# Altium schematic sheet mcu_core.SchDoc
size A4; SheetNumber: 2; SheetTotal: 6
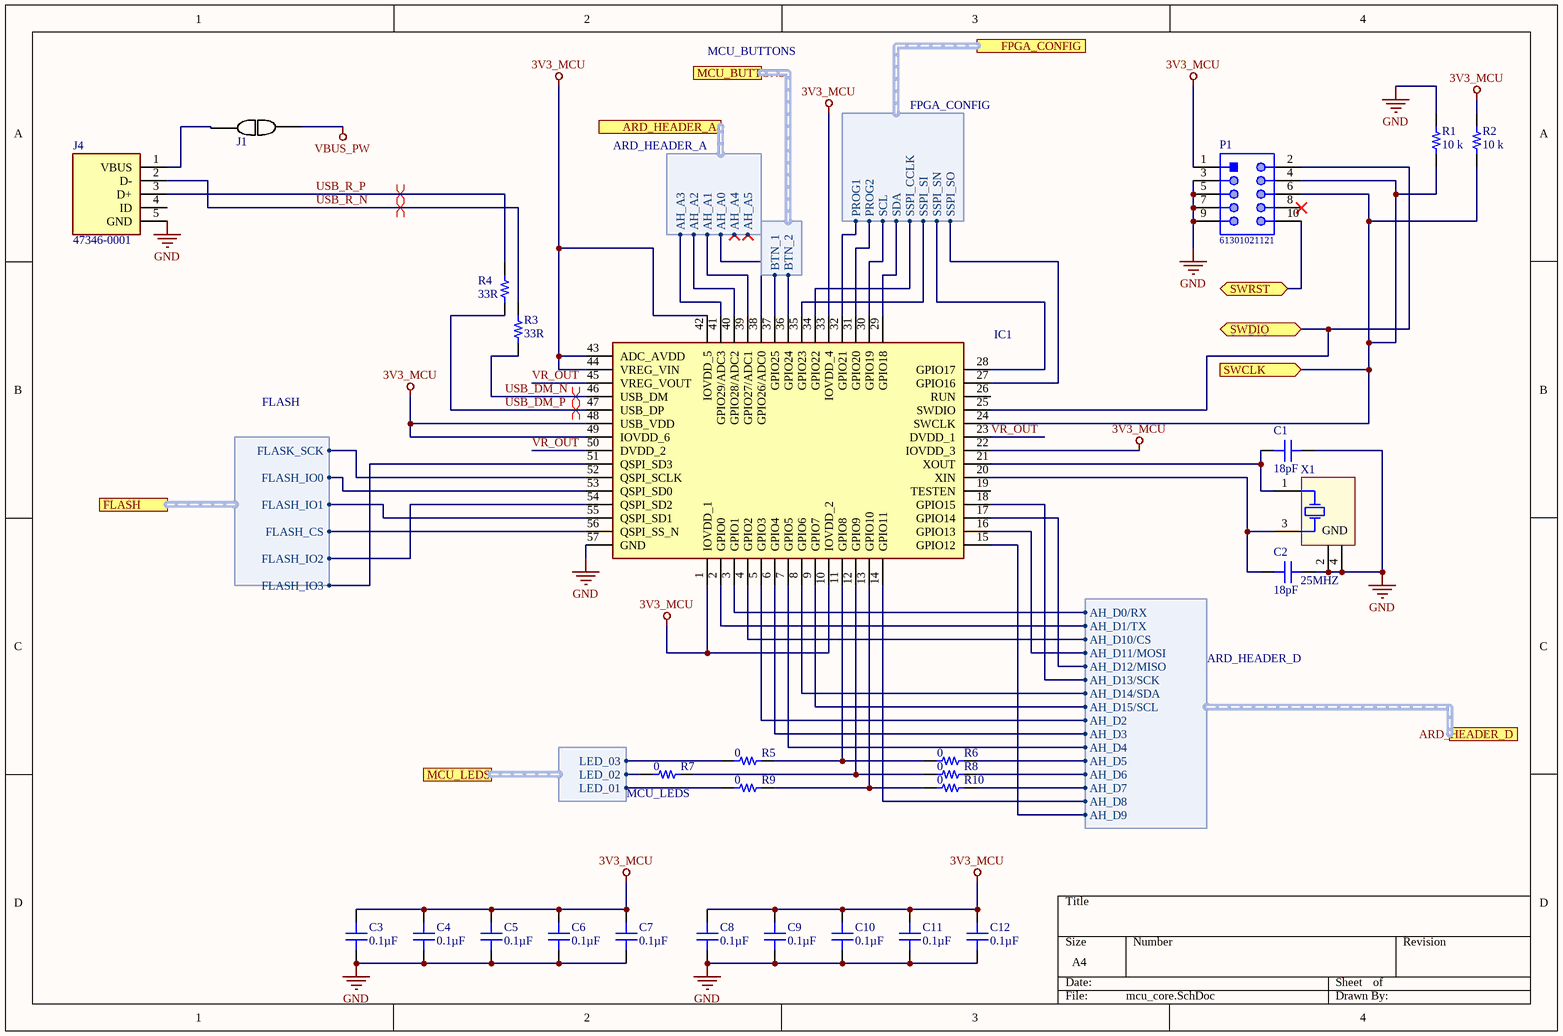
[diagram p0: mcu_core.SchDoc]

## Parts
C1  18pF  [CAP 0603_1608]
C2  18pF  [CAP 0603_1608]
C3  0.1µF  [CAP 0603_1608]
C4  0.1µF  [CAP 0603_1608]
C5  0.1µF  [CAP 0603_1608]
C6  0.1µF  [CAP 0603_1608]
C7  0.1µF  [CAP 0603_1608]
C8  0.1µF  [CAP 0603_1608]
C9  0.1µF  [CAP 0603_1608]
C10  0.1µF  [CAP 0603_1608]
C11  0.1µF  [CAP 0603_1608]
C12  0.1µF  [CAP 0603_1608]
IC1  (no value)  [QFN40P700X700X90-57N-D]
J1  103185-2  [HDRV2W89P0X254_1X2_467X234X820P]  (value not drawn)
J4  47346-0001  [47346-0001]
P1  61301021121  [61301021121]
R1  10 k  [RES 0603_1608]
R2  10 k  [RES 0603_1608]
R3  33R  [RES 0603_1608]
R4  33R  [RES 0603_1608]
R5  0  [RES 0603_1608]
R6  0  [RES 0603_1608]
R7  0  [RES 0603_1608]
R8  0  [RES 0603_1608]
R9  0  [RES 0603_1608]
R10  0  [RES 0603_1608]
X1  25MHZ  [ABRA-ABMM2-4_V]

## Ports
ARD_HEADER_A (harness ARD_HEADER_A), ARD_HEADER_D (harness ARD_HEADER_D), FLASH (harness FLASH), FPGA_CONFIG (harness FPGA_CONFIG), MCU_BUTTONS (harness MCU_BUTTONS), MCU_LEDS (harness MCU_LEDS), SWCLK (in), SWDIO (bidir), SWRST (bidir)

## Harnesses
ARD_HEADER_A: AH_A0, AH_A1, AH_A2, AH_A3, AH_A4, AH_A5
ARD_HEADER_D: AH_D0/RX, AH_D1/TX, AH_D10/CS, AH_D11/MOSI, AH_D12/MISO, AH_D13/SCK, AH_D14/SDA, AH_D15/SCL, AH_D2, AH_D3, AH_D4, AH_D5, AH_D6, AH_D7, AH_D8, AH_D9
FPGA_CONFIG: PROG1, PROG2, SCL, SDA, SSPI_CCLK, SSPI_SI, SSPI_SN, SSPI_SO
MCU_BUTTONS: BTN_1, BTN_2
MCU_LEDS: LED_01, LED_02, LED_03
FLASH: FLASH_IO3, FLASH_IO2, FLASH_CS, FLASH_IO1, FLASH_IO0, FLASK_SCK

## Nets
3V3_MCU: C3.2 C4.2 C5.2 C6.2 C7.2 C8.2 C9.2 C10.2 C11.2 C12.2 IC1.1(IOVDD_1) IC1.10(IOVDD_2) IC1.22(IOVDD_3) IC1.33(IOVDD_4) IC1.42(IOVDD_5) IC1.43(ADC_AVDD) IC1.44(VREG_VIN) IC1.48(USB_VDD) IC1.49(IOVDD_6) P1.1 R2.2
GND: C1.1 C2.1 C3.1 C4.1 C5.1 C6.1 C7.1 C8.1 C9.1 C10.1 C11.1 C12.1 IC1.57(GND) J4.5(GND) P1.3 P1.5 P1.7 P1.9 R1.2 X1.2(GND) X1.4(GND)
VBUS_PW: J1.1
SWCLK: IC1.24(SWCLK) P1.4 P1.6 R1.1 R2.1 ; port SWCLK
SWDIO: IC1.25(SWDIO) P1.2 ; port SWDIO
SWRST: P1.10 ; port SWRST
USB_DM_N: IC1.46(USB_DM) R3.1
USB_DM_P: IC1.47(USB_DP) R4.2
USB_R_N: J4.2(D-) R3.2
USB_R_P: J4.3(D+) R4.1
VR_OUT: IC1.23(DVDD_1) IC1.45(VREG_VOUT) IC1.50(DVDD_2)
NetC1_2: C1.2 IC1.21(XOUT) X1.1(X1)
NetC2_2: C2.2 IC1.20(XIN) X1.3(X2)
NetIC1_2: IC1.2(GPIO0) ; port ARD_HEADER_D.AH_D1/TX
NetIC1_3: IC1.3(GPIO1) ; port ARD_HEADER_D.AH_D0/RX
NetIC1_4: IC1.4(GPIO2) ; port ARD_HEADER_D.AH_D10/CS
NetIC1_5: IC1.5(GPIO3) ; port ARD_HEADER_D.AH_D2
NetIC1_6: IC1.6(GPIO4) ; port ARD_HEADER_D.AH_D3
NetIC1_7: IC1.7(GPIO5) ; port ARD_HEADER_D.AH_D4
NetIC1_8: IC1.8(GPIO6) ; port ARD_HEADER_D.AH_D14/SDA
NetIC1_9: IC1.9(GPIO7) ; port ARD_HEADER_D.AH_D15/SCL
NetIC1_11: IC1.11(GPIO8) R5.2 R6.1
NetIC1_12: IC1.12(GPIO9) R7.2 R8.1
NetIC1_13: IC1.13(GPIO10) R9.2 R10.1
NetIC1_14: IC1.14(GPIO11) ; port ARD_HEADER_D.AH_D8
NetIC1_15: IC1.15(GPIO12) ; port ARD_HEADER_D.AH_D9
NetIC1_16: IC1.16(GPIO13) ; port ARD_HEADER_D.AH_D11/MOSI
NetIC1_17: IC1.17(GPIO14) ; port ARD_HEADER_D.AH_D12/MISO
NetIC1_18: IC1.18(GPIO15) ; port ARD_HEADER_D.AH_D13/SCK
NetIC1_27: IC1.27(GPIO16) ; port FPGA_CONFIG.SSPI_SO
NetIC1_28: IC1.28(GPIO17) ; port FPGA_CONFIG.SSPI_SN
NetIC1_29: IC1.29(GPIO18) ; port FPGA_CONFIG.SDA
NetIC1_30: IC1.30(GPIO19) ; port FPGA_CONFIG.SCL
NetIC1_31: IC1.31(GPIO20) ; port FPGA_CONFIG.PROG2
NetIC1_32: IC1.32(GPIO21) ; port FPGA_CONFIG.PROG1
NetIC1_34: IC1.34(GPIO22) ; port FPGA_CONFIG.SSPI_CCLK
NetIC1_35: IC1.35(GPIO23) ; port FPGA_CONFIG.SSPI_SI
NetIC1_36: IC1.36(GPIO24) ; port MCU_BUTTONS.BTN_2
NetIC1_37: IC1.37(GPIO25) ; port MCU_BUTTONS.BTN_1
NetIC1_38: IC1.38(GPIO26/ADC0) ; port ARD_HEADER_A.AH_A0
NetIC1_39: IC1.39(GPIO27/ADC1) ; port ARD_HEADER_A.AH_A1
NetIC1_40: IC1.40(GPIO28/ADC2) ; port ARD_HEADER_A.AH_A2
NetIC1_41: IC1.41(GPIO29/ADC3) ; port ARD_HEADER_A.AH_A3
NetIC1_51: IC1.51(QSPI_SD3) ; port FLASH.FLASH_IO3
NetIC1_52: IC1.52(QSPI_SCLK) ; port FLASH.FLASK_SCK
NetIC1_53: IC1.53(QSPI_SD0) ; port FLASH.FLASH_IO0
NetIC1_54: IC1.54(QSPI_SD2) ; port FLASH.FLASH_IO2
NetIC1_55: IC1.55(QSPI_SD1) ; port FLASH.FLASH_IO1
NetIC1_56: IC1.56(QSPI_SS_N) ; port FLASH.FLASH_CS
NetJ1_2: J1.2 J4.1(VBUS)
NetR5_1: R5.1 ; port MCU_LEDS.LED_03
NetR6_2: R6.2 ; port ARD_HEADER_D.AH_D5
NetR7_1: R7.1 ; port MCU_LEDS.LED_02
NetR8_2: R8.2 ; port ARD_HEADER_D.AH_D6
NetR9_1: R9.1 ; port MCU_LEDS.LED_01
NetR10_2: R10.2 ; port ARD_HEADER_D.AH_D7

Not connected (* = marked no-connect by the designer): IC1 19(TESTEN) 26(RUN); J4 4(ID); P1 8*

## Layout directives
differential pair: USB_DM_N, USB_DM_P, USB_R_N, USB_R_P

## Library data of the parts
C1 C2 = VJ0603A180FXQCW1BC: CAP CER 18PF 10V C0G/NP0 0603; Manufacturer: Vishay Vitramon; Temperature Coefficient: C0G, NP0; Tolerance: ±1%; Part Number: VJ0603A180FXQCW1BC; Value: 18pF; Applications: General Purpose; Capacitance: 18pF; ComponentLink1Description: Datasheet; ComponentLink1URL: https://www.vishay.com/docs/28548/vjw1bcbascomseries.pdf; ComponentLink2Description: DigiKey Link; ComponentLink2URL: http://digikey.com/product-detail/en/vishay-vitramon/VJ0603A180FXQCW1BC/720-1660-1-ND/8324080; Device Package: 0603 (1608 Metric); LastUpdated: 02.09.2020 1:03:27; Lifecycle Status: Active; Minimum Order: 1; Mounting Type: Surface Mount, MLCC; Operating Temperature: -55°C ~ 125°C; Package / Case: 0603 (1608 Metric); Packaging: TapeAndReel; PartId: 7094; Part Status: Active; Price: 0.04; Series: VJ; Size / Dimension: 0.063" L x 0.031" W (1.60mm x 0.80mm); Supplier 1: DigiKey; Supplier Part Number 1: 720-1660-1-ND; Thickness (Max): 0.034" (0.87mm); Voltage - Rated: 10V
C3-C12 = C0603C104K5RAC7411: CAP CER 0.1UF 50V X7R 0603; Manufacturer: KEMET; Tolerance: ±10%; Part Number: C0603C104K5RAC7411; Value: 0.1µF; Applications: Bypass, Decoupling; Capacitance: 0.1µF; ComponentLink1Description: Datasheet; ComponentLink1URL: https://api.kemet.com/component-edge/download/datasheet/C0603C104K5RAC7411.pdf; ComponentLink2Description: DigiKey Link; ComponentLink2URL: http://digikey.com/product-detail/en/kemet/C0603C104K5RAC7411/399-7374-2-ND/3317013; Device Package: 0603 (1608 Metric); LastUpdated: 02.09.2020 1:03:36; Lifecycle Status: Active; Minimum Order: 15000; Mounting Type: Surface Mount, MLCC; Operating Temperature: -55°C ~ 125°C; Package / Case: 0603 (1608 Metric); Packaging: TapeAndReel; PartId: 2233; Part Status: Active; Price: 0.02; Series: SMD Comm X7R; Size / Dimension: 0.063" L x 0.031" W (1.60mm x 0.80mm); Supplier 1: DigiKey; Supplier Part Number 1: 399-7374-2-ND; Temperature Coefficient: X7R; Thickness (Max): 0.035" (0.90mm); Voltage - Rated: 50V
IC1 = RP2040: Integrated Circuit; Manufacturer_Name: RASPBERRY-PI; Datasheet Link: https://datasheets.raspberrypi.org/rp2040/rp2040-datasheet.pdf; Height: 0.9mm; Manufacturer_Part_Number: RP2040
J1 = 103185-2: 02 MODII HDR SRST B/A .100CL; Package: None; Price: None; Value: *; MP: 103185-2; Availability: Unavailable
J4 = 47346-0001: Connector; Manufacturer_Name: Molex; Datasheet Link: http://www.molex.com/pdm_docs/sd/473460001_sd.pdf; Manufacturer_Part_Number: 47346-0001; Mouser Part Number: 538-47346-0001; Mouser Price/Stock: https://www.mouser.co.uk/ProductDetail/Molex/47346-0001?qs=c2CV6XM0DweJBWaSeyWeCw%3D%3D
P1 = CMP-1502-01084-1: THT Vertical Pin Header WR-PHD, Pitch 2.54 mm, Dual Row, 10 pins; Manufacturer: Wurth Elektronik; Working Voltage: 250VAC; Pitch: 2.54mm; Contact Resistance: 20mOhm; Gender: Male; Rated Current: 3A; Withstanding Voltage: 500VAC; Pin Number: 10; Operating Temperature: -40to105degC; Mounting Technology: THT; Publisher: WurthElektronik; Manufacturer URL: http://www.we-online.de; Part Number: 61301021121; Row Number: Dual; Packaging: Bag; Orientation: Vertical; Package Reference: 61301021121; Datasheet URL: https://katalog.we-online.de/em/datasheet/6130xx21121.pdf
R1 R2 = RNCS0603BKE10K0: RES 10K OHM 0.1% 1/16W 0603; Manufacturer: Stackpole Electronics Inc; Power (Watts): 0.063W, 1/16W; Resistance: 10 kOhms; Temperature Coefficient: ±25ppm/°C; Part Number: RNCS0603BKE10K0; Value: 10 k; ComponentLink1Description: Datasheet; ComponentLink1URL: https://www.seielect.com/catalog/sei-rncs_rnch.pdf; ComponentLink2Description: DigiKey Link; ComponentLink2URL: http://digikey.com/product-detail/en/stackpole-electronics-inc/RNCS0603BKE10K0/RNCS0603BKE10K0CT-ND/1800113; Composition: Thin Film; Device Package: 0603 (1608 Metric); Features: Anti-Corrosive, Automotive AEC-Q200, Moisture Resistant; Height - Seated (Max): 0.022" (0.55mm); LastUpdated: 02.09.2020 1:10:25; Lifecycle Status: Active; Minimum Order: 1; Number of Terminations: 2; Operating Temperature: -55°C ~ 155°C; Package / Case: 0603 (1608 Metric); Packaging: TapeAndReel; PartId: 4838; Part Status: Active; Price: 0.08; Ratings: AEC-Q200; Series: RNCS; Size / Dimension: 0.061" L x 0.031" W (1.55mm x 0.80mm); Supplier 1: DigiKey; Supplier Part Number 1: RNCS0603BKE10K0CT-ND; Supplier Device Package: 0603; Tolerance: ±0.1%
R3 R4 = CPF0603B33RE: RES SMD 33 OHM 0.1% 1/16W 0603; Manufacturer: TE Connectivity Passive Product; Power (Watts): 0.063W, 1/16W; Resistance: 33 Ohms; Temperature Coefficient: ±25ppm/°C; Part Number: CPF0603B33RE; Value: 33R; ComponentLink1Description: Datasheet; ComponentLink1URL: https://www.te.com/commerce/DocumentDelivery/DDEController?Action=srchrtrv&DocNm=1773200&DocType=DS&DocLang=English; ComponentLink2Description: DigiKey Link; ComponentLink2URL: http://digikey.com/product-detail/en/te-connectivity-passive-product/CPF0603B33RE/A119909CT-ND/4966507; Composition: Thin Film; Device Package: 0603 (1608 Metric); Height - Seated (Max): 0.022" (0.55mm); LastUpdated: 02.09.2020 1:10:25; Lifecycle Status: Active; Minimum Order: 1; Number of Terminations: 2; Operating Temperature: -55°C ~ 155°C; Package / Case: 0603 (1608 Metric); Packaging: TapeAndReel; PartId: 4881; Part Status: Active; Price: 0.09; Series: CPF, Neohm; Size / Dimension: 0.061" L x 0.031" W (1.55mm x 0.80mm); Supplier 1: DigiKey; Supplier Part Number 1: A119909CT-ND; Supplier Device Package: 0603; Tolerance: ±0.1%
R5-R10 = TLRZ1JTTD: RES 0 OHM JUMPER 0603; Manufacturer: KOA Speer Electronics, Inc.; Part Number: TLRZ1JTTD; ComponentLink1Description: Datasheet; ComponentLink1URL: http://www.koaspeer.com/catimages/Products/TLRZ/TLRZ.pdf; ComponentLink2Description: DigiKey Link; ComponentLink2URL: http://digikey.com/product-detail/en/koa-speer-electronics-inc/TLRZ1JTTD/2019-TLRZ1JTTDCT-ND/9847537; Composition: Metal Element; Device Package: 0603 (1608 Metric); Features: Automotive AEC-Q200, Current Sense; Height - Seated (Max): 0.022" (0.55mm); LastUpdated: 02.09.2020 1:10:25; Lifecycle Status: Active; Minimum Order: 1; Number of Terminations: 2; Operating Temperature: -55°C ~ 170°C; Package / Case: 0603 (1608 Metric); Packaging: TapeAndReel; PartId: 4851; Part Status: Active; Price: 0.08; Ratings: AEC-Q200; Series: TLRZ; Size / Dimension: 0.063" L x 0.031" W (1.60mm x 0.80mm); Supplier 1: DigiKey; Supplier Part Number 1: 2019-TLRZ1JTTDCT-ND; Supplier Device Package: 0603; Tolerance: Jumper
X1 = CMP-0277-00003-1: Ceramic Surface Mount Low Profile Quartz Crystal, 8 MHz, -20 to 70 degC, 4-Pin 6 x 3.6 x 1.2 mm SMD, RoHS, 1000pcs / Reel; Manufacturer: Abracon; PartNumber: ABMM2-8.000MHZ-E2-T; ESR: 72 Ohm Max.; Frequency: 8 MHz; Shunt Capacitance C0: 7 pF Max.; Load Capacitance CL: 18 pF Typ.; ComponentLink3Description: Package Specification; PackageDescription: 4-Pin SMD, Body 6 x 3.6 mm, Pitch 4.4 mm; DatasheetVersion: Jan-13; ComponentLink1URL: http://www.abracon.com/; ComponentLink2URL: http://www.abracon.com/Resonators/ABMM2.pdf; Temperature Range: -20 to 70 degC; Mounting Technology: Surface Mount; RoHS: TRUE; ComponentLink2Description: Datasheet; ComponentLink3URL: http://www.abracon.com/Resonators/ABMM2.pdf; ComponentLink1Description: Manufacturer URL; Packing: 1000pcs / Reel